# Altium project MEZON_NEGATIVE.PrjPCB
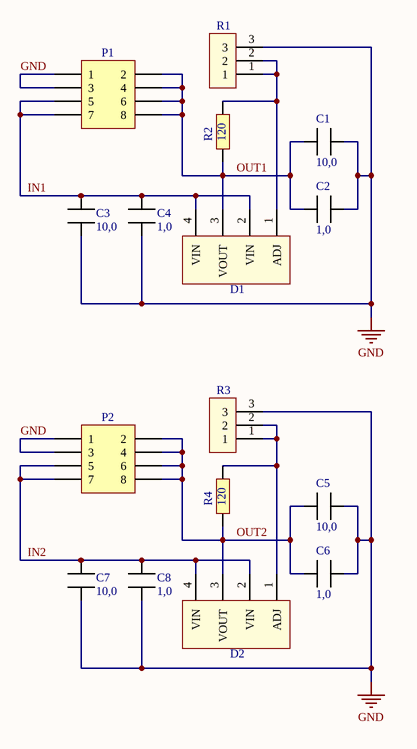
[diagram p0: MEZON_NEGATIVE.SchDoc]
1 sheet, 16 parts. Net scope: global (net labels, ports and power ports of the same name join across sheets).
Board file: MEZON_NEGATIVE.PcbDoc

## Sheet MEZON_NEGATIVE.SchDoc
size A4

### Parts
C1  10,0  [Cap_BIG]
C2  1,0  [CAP_SMALL]
C3  10,0  [Cap_BIG]
C4  1,0  [CAP_SMALL]
C5  10,0  [Cap_BIG]
C6  1,0  [CAP_SMALL]
C7  10,0  [Cap_BIG]
C8  1,0  [CAP_SMALL]
D1  LM337  [SOT230P700X180-4N]  (value not drawn)
D2  LM337  [SOT230P700X180-4N]  (value not drawn)
P1  Header 4X2  [HDR2X4]  (value not drawn)
P2  Header 4X2  [HDR2X4]  (value not drawn)
R1  3296  [PODSTR_RES_3296]  (value not drawn)
R2  120  [RES]
R3  3296  [PODSTR_RES_3296]  (value not drawn)
R4  120  [RES]

### Nets
GND: C1.2 C2.1 C3.1 C4.1 C5.2 C6.1 C7.1 C8.1 P1.1 P1.3 P2.1 P2.3 R1.3 R3.3
IN1: C3.2 C4.2 D1.2(VIN) D1.4(VIN) P1.5 P1.7
IN2: C7.2 C8.2 D2.2(VIN) D2.4(VIN) P2.5 P2.7
OUT1: C1.1 C2.2 D1.3(VOUT) P1.2 P1.4 P1.6 P1.8 R2.1
OUT2: C5.1 C6.2 D2.3(VOUT) P2.2 P2.4 P2.6 P2.8 R4.1
NetD1_1: D1.1(ADJ) R1.1 R1.2 R2.2
NetD2_1: D2.1(ADJ) R3.1 R3.2 R4.2

### Library data of the parts
C1 C3 C5 C7 = CAP_BIG
C2 C4 C6 C8 = CAP_SMALL
P1 P2 = Header 4X2: Header, 4-Pin, Dual row; LatestRevisionDate: 17-Jul-2002; LatestRevisionNote: Re-released for DXP Platform.; Publisher: Altium Limited
R1 R3 = PODSTR_RES_NEW
R2 R4 = RES